# EAGLE design untitled (EAGLE 6.1)
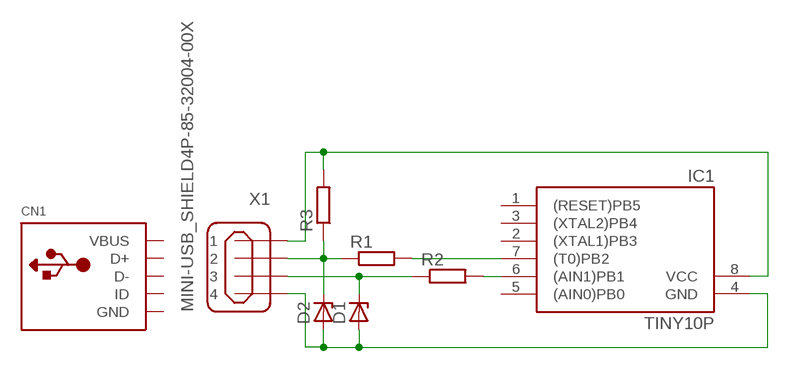
[diagram p0: schematic, sheet 1]

## Parts
CN1  USBTHM  [USB-MINIB-THM]
D1  ZENER-DIODEZD-2.5  [ZDIO-2.5]
D2  ZENER-DIODEZD-5  [ZDIO-5]
IC1  TINY10P  [DIL08]
R1  R-EU_0204/2V  [0204V]
R2  R-EU_0204/2V  [0204V]
R3  R-EU_0204/2V  [0204V]
X1  MINI-USB_SHIELD4P-85-32004-00X  [85-32004-00X]

## Nets
N$1: IC1.6((AIN1)PB1) R2.2
N$2: IC1.7((T0)PB2) R1.2
N$3: D2.C R1.1 R3.1 X1.2
N$4: D1.C R2.1 X1.3
N$5: IC1.8(VCC) R3.2 X1.1
N$6: D1.A D2.A IC1.4(GND) X1.4
Unconnected: CN1.D+ CN1.D- CN1.ID IC1.1((RESET)PB5) IC1.2((XTAL1)PB3) IC1.3((XTAL2)PB4) IC1.5((AIN0)PB0) X1.M1(S1) X1.M2(S2)

## Power pins joined to a net without a drawn wire
GND: CN1.GND
VBUS: CN1.VBUS

## Library data of the parts
CN1 = adafruit:USB: USB Connectors USBMINIB - Surface Mount Female Mini-B USB Connector 4UConnector: 06564 By microbuilder.eu Thru-hole RA Female Mini-B USB Connector 4UConnector: 18732 By ladyada.net
D1 D2 = diode:ZENER-DIODE: Z-Diode
IC1 = atmel:TINY10: MICROCONTROLLER 1 Kbytes ROM; OC_FARNELL: unknown; OC_NEWARK: unknown
R1-R3 = rcl:R-EU_: RESISTOR, European symbol
X1 = con-cypressindustries:MINI-USB_SHIELD4P-: MINI USB 4 Pol. Source: www.cypressindustries.com; OC_FARNELL: unknown; OC_NEWARK: unknown

## Board
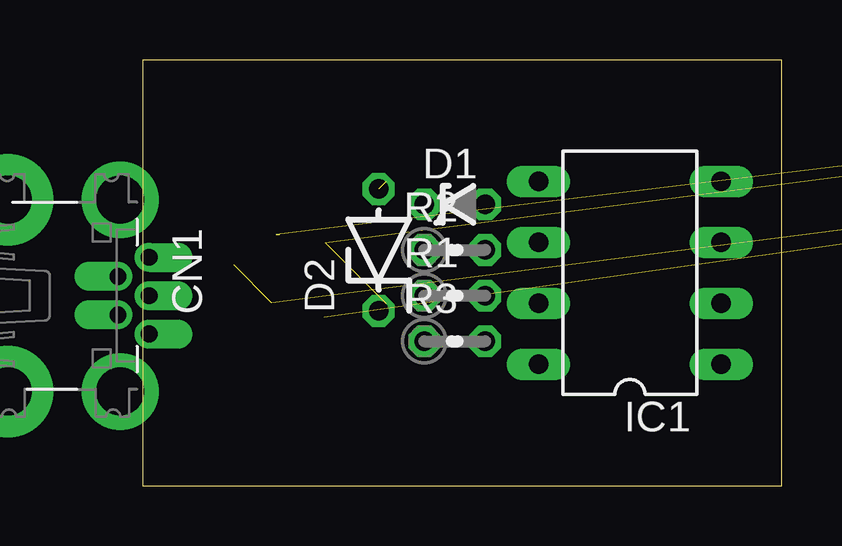
[diagram p1: board, top side]
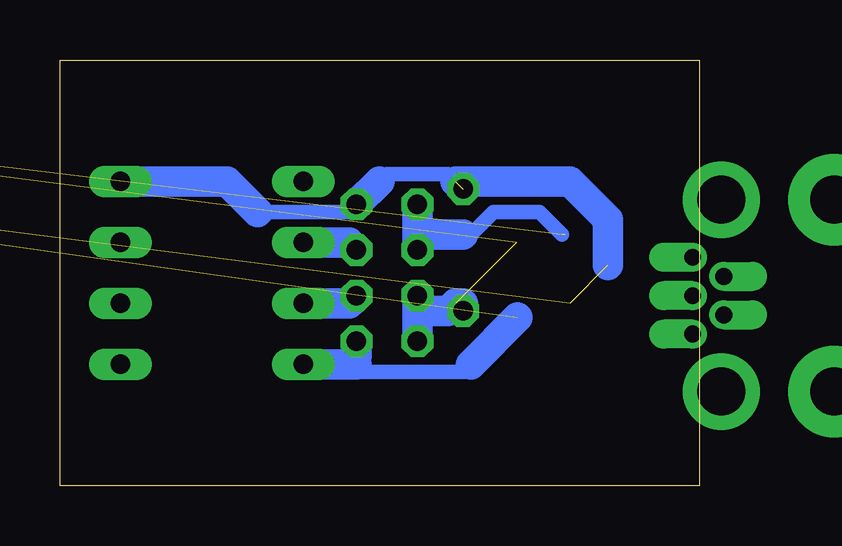
[diagram p2: board, bottom side, seen from below]

Size 26.65 x 17.77 mm. Coordinates in mm from the lower left corner, seen from the top.
Outline: 0,0 26.65,0 26.65,17.77 0,17.77 0,0
Copper layers (1*16): Top 0.035mm / dielectric 1.5mm / Bottom 0.035mm
Design rules: minimum track width 10mil, minimum drill 24mil, track to track 8mil, track to pad 8mil, pad to pad 8mil, via to via 8mil, smd to smd 8mil, copper to edge 40mil, drill to drill 8mil, minimum pad ring 10mil, minimum via ring 8mil, stop-mask expansion 4mil, vias tented up to drill 0mil, thermal gap 10mil

### Footprints (pad centres in the part's own frame; a part is rotated, then mirrored left to right if it is on the bottom)
USB-MINIB-THM = drill 0.7 offset: D+ 0,9.8; D- -0.8,8.5; GND 1.6,9.8; ID 0.8,8.5; VBUS -1.6,9.8 | drill 2 pad 3.81: GND1 -4,3.9; GND4 4,3.9 | drill 2 pad 3.2: GND2 -4,8.6; GND3 4,8.6
ZDIO-2.5 = drill 0.813 octagon: A 1.27,0; C -1.27,0
ZDIO-5 = drill 0.813 octagon: A 2.54,0; C -2.54,0
DIL08 = drill 0.813 long: 1 -3.81,-3.81; 2 -1.27,-3.81; 3 1.27,-3.81; 4 3.81,-3.81; 5 3.81,3.81; 6 1.27,3.81; 7 -1.27,3.81; 8 -3.81,3.81
0204V = drill 0.813 octagon: 1 -1.27,0; 2 1.27,0
85-32004-00X = drill 0.92 pad 1.27: 1 4.71,-1.25; 2 4.71,1.25; 3 2.71,1.25; 4 2.71,-1.25 | drill 2.3 pad 3: M1 0,6.02; M2 0,-6.02

### Placement (x,y rotation side)
CN1  -9.52,7.94 270 top
D1  13.02,11.75 0 top
D2  9.84,9.84 90 top
IC1  20.32,8.89 90 top
R1  13.02,7.94 0 top
R2  13.02,9.84 0 top
R3  13.02,6.03 0 top
X1  49.85,14.92 0 top  (outside the outline)

### Tracks (layer width: path | path; a pad name or v marks a point on that pad's centre or on a via)
N$1
  Bottom 1.27: R2.2 14.6,10.16 IC1.6
N$2
  Bottom 1.27: R1.2 14.6,7.62 IC1.7
N$3  (2 unrouted)
  Bottom 1.27: R1.1 11.75,7.3 | 11.75,7.3 R3.1 | 11.75,7.3 10.48,7.3 10.16,7.62 9.84,7.62 D2.C
N$4  (2 unrouted)
  Bottom 0.61: 5.72,10.48 6.67,11.43 8.57,11.43 9.52,10.48 9.84,10.48
  Bottom 1.27: R2.1 11.75,10.48 | 11.75,10.48 D1.C | 9.84,10.48 11.75,10.48
N$5  (1 unrouted)
  Bottom 0.61: 9.52,5.08 9.52,4.76 14.29,4.76 14.29,5.08
  Bottom 1.27: 14.29,5.08 14.6,5.08 | 14.6,5.08 IC1.8 | R3.2 14.29,5.4 14.6,5.08 | 7.57,7.04 9.52,5.08
N$6  (3 unrouted)
  Bottom 0.61: D1.A 14.6,11.43 18.41,11.43 | 10.16,12.7 10.48,13.02 13.02,13.02 13.34,12.7
  Bottom 1.27: 18.41,11.43 19.69,12.7 IC1.4 | 3.81,9.21 3.81,11.11 5.4,12.7 10.16,12.7 | D1.A 13.34,12.7